# EAGLE design pager_v2 (EAGLE 7.5.0)
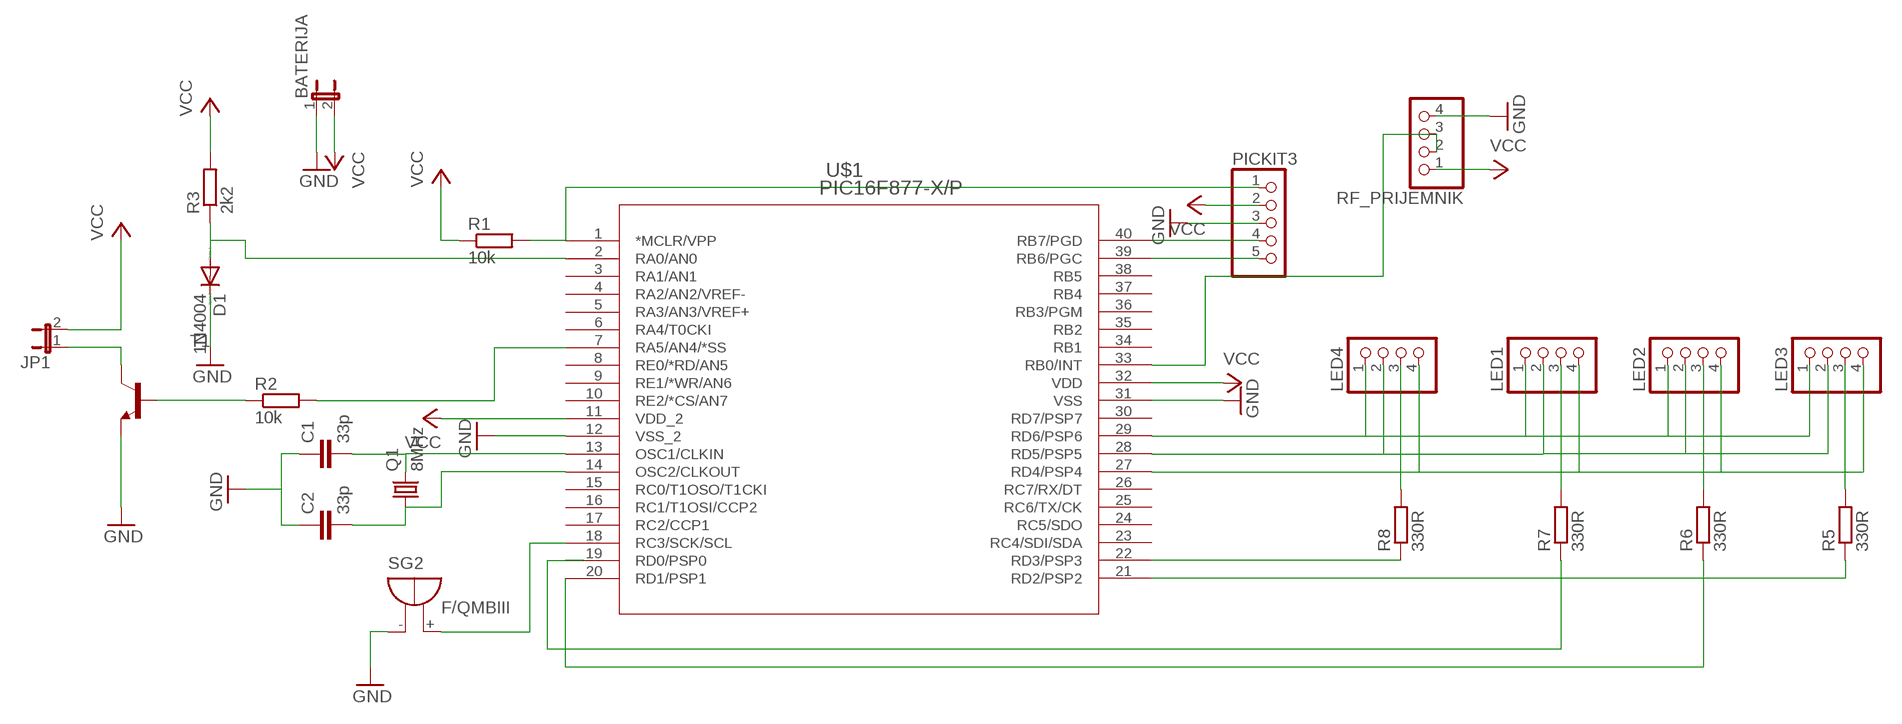
[diagram p0: schematic, sheet 1]

## Parts
BATERIJA  JP1E  [JP1]
C1  33p  C-EU025-024X044  [C025-024X044]
C2  33p  C-EU025-024X044  [C025-024X044]
D1  1N4004  [DO41-10]
JP1  JP1E  [JP1]
LED1  PINHD-1X4  [1X04]
LED2  PINHD-1X4  [1X04]
LED3  PINHD-1X4  [1X04]
LED4  PINHD-1X4  [1X04]
PICKIT3  PINHD-1X5  [1X05]
Q1  8MHz  CRYSTALHC49S  [HC49/S]
R1  10k  R-EU_0207/10  [0207/10]
R2  10k  R-EU_0207/10  [0207/10]
R3  2k2  R-EU_0207/10  [0207/10]
R5  330R  R-EU_0207/10  [0207/10]
R6  330R  R-EU_0207/10  [0207/10]
R7  330R  R-EU_0207/10  [0207/10]
R8  330R  R-EU_0207/10  [0207/10]
RF_PRIJEMNIK  PINHD-1X4  [1X04]
SG2  F/QMBIII  [F/QMBIII]
T1  -NPN-TO92-EBC  [TO92-EBC]
U$1  PIC16F877-X/P  [PDIP40_600MC]

## Nets
GND: BATERIJA.1 C1.1 C2.1 D1.C PICKIT3.3 RF_PRIJEMNIK.4 SG2.-(+) T1.E U$1.12(VSS_2) U$1.31(VSS)
N$1: C1.2 Q1.2 U$1.13(OSC1/CLKIN)
N$2: LED4.3 R8.2
N$3: C2.2 Q1.1 U$1.14(OSC2/CLKOUT)
N$4: PICKIT3.1 R1.2 U$1.1(*MCLR/VPP)
N$5: LED2.3 R6.2
N$6: R2.1 T1.B
N$7: JP1.1 T1.C
N$8: SG2.+(-) U$1.18(RC3/SCK/SCL)
N$9: RF_PRIJEMNIK.2 RF_PRIJEMNIK.3 U$1.33(RB0/INT)
N$10: LED3.3 R5.2
N$11: LED1.3 R7.2
N$12: LED1.2 LED2.2 LED3.2 LED4.2 U$1.28(RD5/PSP5)
N$13: R7.1 U$1.19(RD0/PSP0)
N$14: R6.1 U$1.20(RD1/PSP1)
N$15: R8.1 U$1.22(RD3/PSP3)
N$16: R5.1 U$1.21(RD2/PSP2)
N$17: LED1.4 LED2.4 LED3.4 LED4.4 U$1.27(RD4/PSP4)
N$18: R2.2 U$1.7(RA5/AN4/*SS)
N$19: LED1.1 LED2.1 LED3.1 LED4.1 U$1.29(RD6/PSP6)
N$20: PICKIT3.4 U$1.40(RB7/PGD)
N$21: PICKIT3.5 U$1.39(RB6/PGC)
N$22: D1.A R3.1 U$1.2(RA0/AN0)
VCC: BATERIJA.2 JP1.2 PICKIT3.2 R1.1 R3.2 RF_PRIJEMNIK.1 U$1.11(VDD_2) U$1.32(VDD)
Unconnected: U$1.3(RA1/AN1) U$1.4(RA2/AN2/VREF-) U$1.5(RA3/AN3/VREF+) U$1.6(RA4/T0CKI) U$1.8(RE0/*RD/AN5) U$1.9(RE1/*WR/AN6) U$1.10(RE2/*CS/AN7) U$1.15(RC0/T1OSO/T1CKI) U$1.16(RC1/T1OSI/CCP2) U$1.17(RC2/CCP1) U$1.23(RC4/SDI/SDA) U$1.24(RC5/SDO) U$1.25(RC6/TX/CK) U$1.26(RC7/RX/DT) U$1.30(RD7/PSP7) U$1.34(RB1) U$1.35(RB2) U$1.36(RB3/PGM) U$1.37(RB4) U$1.38(RB5)

## Library data of the parts
BATERIJA JP1 = jumper:JP1E: JUMPER
C1 C2 = rcl:C-EU: CAPACITOR, European symbol
D1 = diode:1N4004: DIODE general purpose rectifier, 1 A
LED1-LED4 RF_PRIJEMNIK = pinhead:PINHD-1X4: PIN HEADER
PICKIT3 = pinhead:PINHD-1X5: PIN HEADER
Q1 = crystal:CRYSTAL: CRYSTAL; OC_FARNELL: 1667008; OC_NEWARK: unknown
R1-R3 R5-R8 = resistor:R-EU_: RESISTOR, European symbol
SG2 = buzzer:F/QMBIII: BUZZER Source: Buerklin; OC_FARNELL: unknown; OC_NEWARK: unknown
T1 = transistor:*-NPN-: NPN Transistror BF959 corrected 2008.03.06
U$1 = PIC16F877A:PIC16F877-X/P

## Board
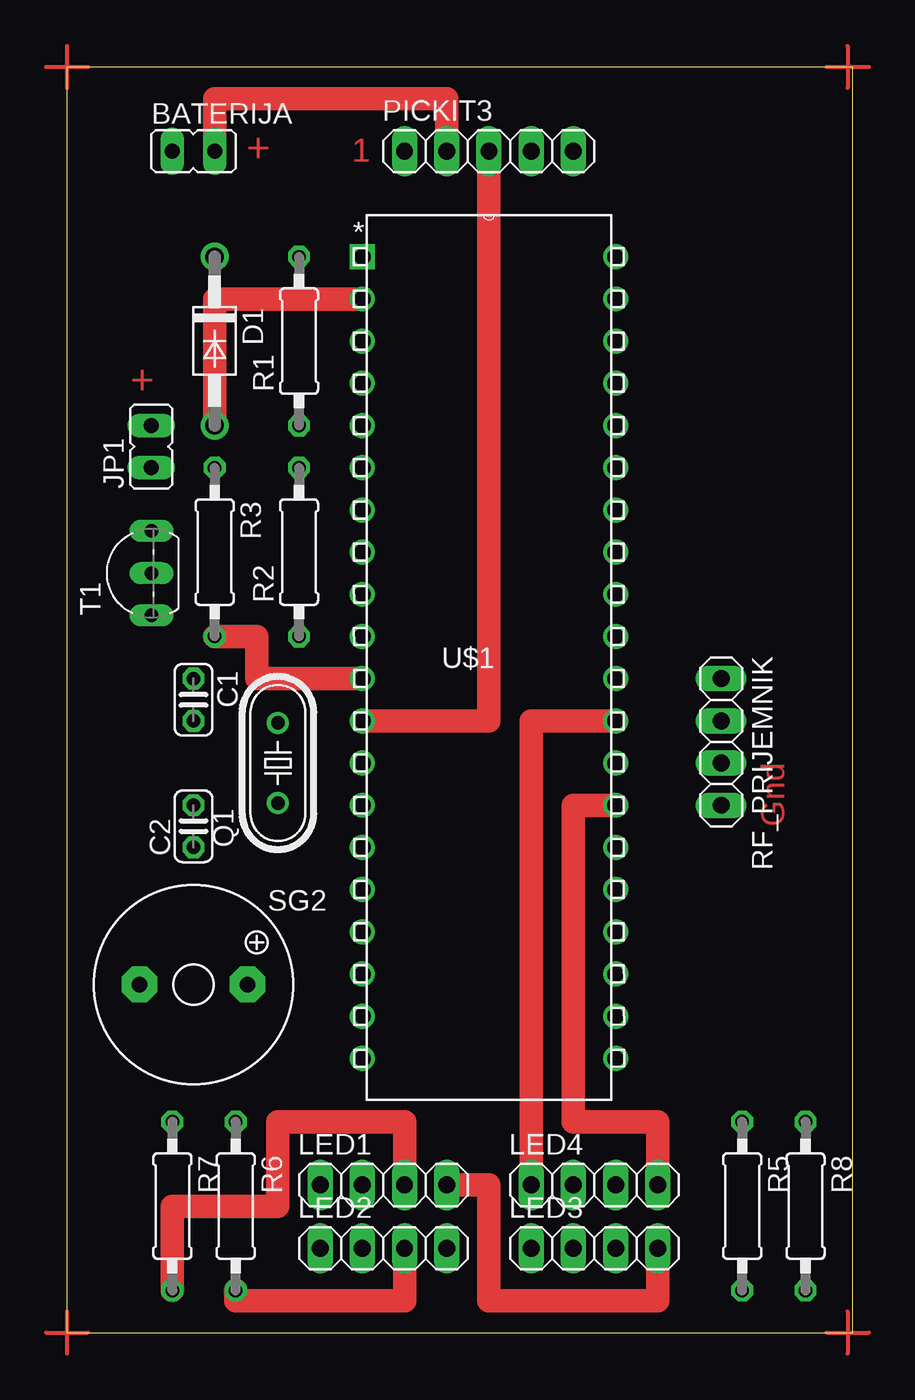
[diagram p1: board, top side]
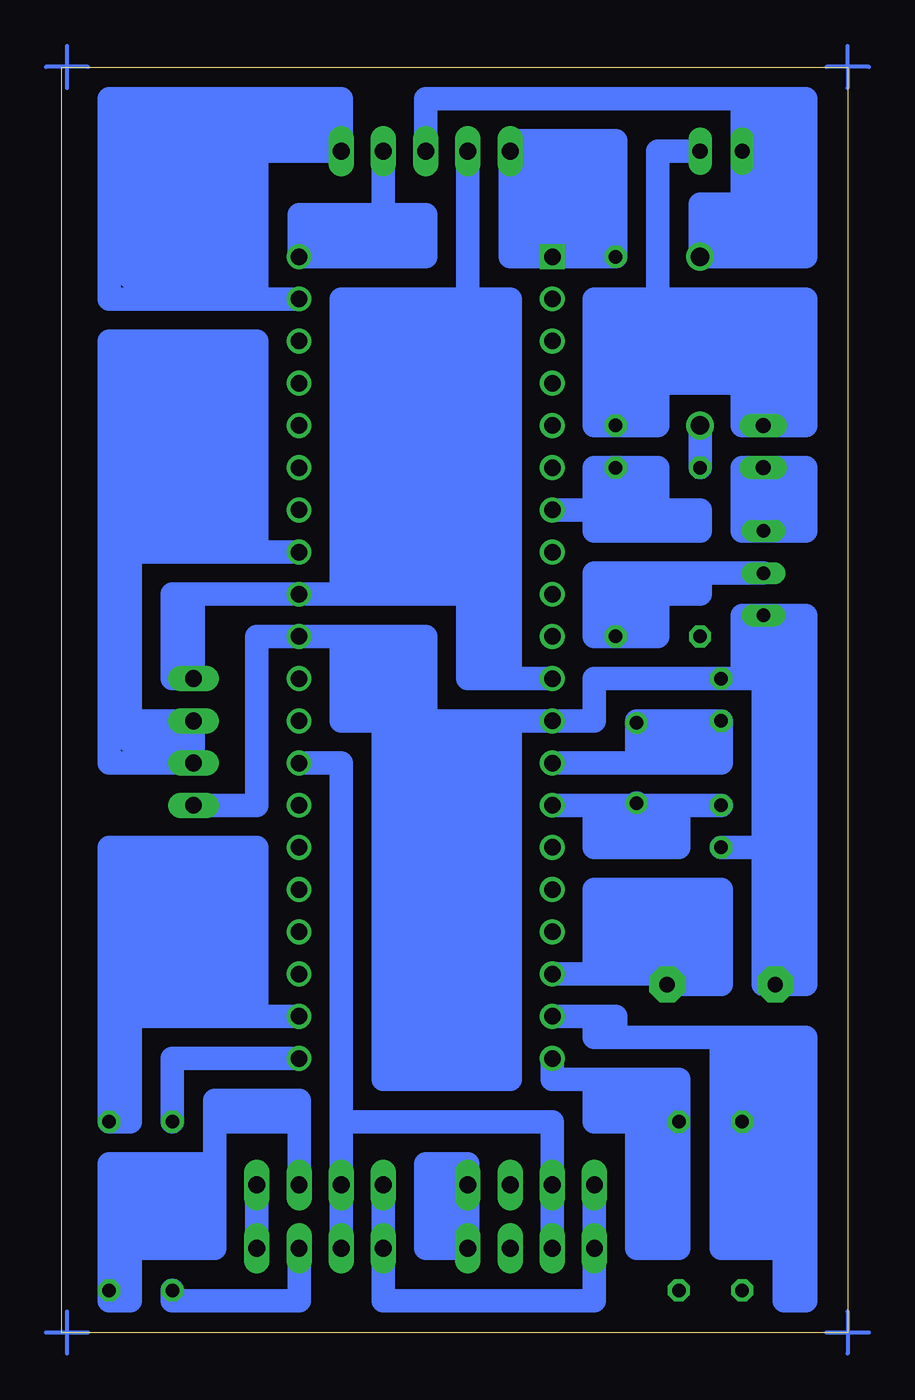
[diagram p2: board, bottom side, seen from below]

Size 47.3 x 76.19 mm. Coordinates in mm from the lower left corner, seen from the top.
Outline: 0,0 47.3,0 47.3,76.19 0,76.19 0,0
Copper layers (1*16): Top 0.035mm / dielectric 1.5mm / Bottom 0.035mm
Design rules "default": minimum track width 10mil, minimum drill 24mil, track to track 8mil, track to pad 8mil, pad to pad 8mil, via to via 8mil, smd to smd 8mil, copper to edge 40mil, drill to drill 8mil, minimum pad ring 10mil, minimum via ring 8mil, stop-mask expansion 4mil, vias tented up to drill 0mil, thermal gap 10mil

### Footprints (pad centres in the part's own frame; a part is rotated, then mirrored left to right if it is on the bottom)
JP1 = drill 0.914 long: 1 0,-1.27; 2 0,1.27
C025-024X044 = drill 0.813 octagon: 1 -1.27,0; 2 1.27,0
DO41-10 = drill 1.118: A 5.08,0; C -5.08,0
1X04 = drill 1.016 long: 1 -3.81,0; 2 -1.27,0; 3 1.27,0; 4 3.81,0
1X05 = drill 1.016 long: 1 -5.08,0; 2 -2.54,0; 3 0,0; 4 2.54,0; 5 5.08,0
HC49/S = drill 0.813: 1 -2.413,0; 2 2.413,0
0207/10 = drill 0.813 octagon: 1 -5.08,0; 2 5.08,0
F/QMBIII = drill 0.914 pad 2.159 octagon: + 3.251,0; - -3.251,0
TO92-EBC = drill 0.813 long: B 0,-1.27; C 2.54,-1.27; E -2.54,-1.27
PDIP40_600MC = drill 0.991 square: 1 -15.24,48.26 | drill 0.991: 2 -15.24,45.72; 3 -15.24,43.18; 4 -15.24,40.64; 5 -15.24,38.1; 6 -15.24,35.56; 7 -15.24,33.02; 8 -15.24,30.48; 9 -15.24,27.94; 10 -15.24,25.4; 11 -15.24,22.86; 12 -15.24,20.32; 13 -15.24,17.78; 14 -15.24,15.24; 15 -15.24,12.7; 16 -15.24,10.16; 17 -15.24,7.62; 18 -15.24,5.08; 19 -15.24,2.54; 20 -15.24,0; 21 0,0; 22 0,2.54; 23 0,5.08; 24 0,7.62; 25 0,10.16; 26 0,12.7; 27 0,15.24; 28 0,17.78; 29 0,20.32; 30 0,22.86; 31 0,25.4; 32 0,27.94; 33 0,30.48; 34 0,33.02; 35 0,35.56; 36 0,38.1; 37 0,40.64; 38 0,43.18; 39 0,45.72; 40 0,48.26

### Placement (x,y rotation side)
BATERIJA  7.62,71.12 270 top
C1  7.62,38.1 270 top
C2  7.62,30.48 90 top
D1  8.89,59.69 270 top
JP1  5.08,53.34 0 top
LED1  19.05,8.89 0 top
LED2  19.05,5.08 0 top
LED3  31.75,5.08 0 top
LED4  31.75,8.89 0 top
PICKIT3  25.4,71.12 0 top
Q1  12.7,34.29 90 top
R1  13.97,59.69 90 top
R2  13.97,46.99 90 top
R3  8.89,46.99 270 top
R5  40.64,7.62 270 top
R6  10.16,7.62 270 top
R7  6.35,7.62 270 top
R8  44.45,7.62 270 top
RF_PRIJEMNIK  39.37,35.56 270 top
SG2  7.62,20.96 0 top
T1  3.81,45.72 90 top
U$1  33.02,16.51 0 top

### Tracks (layer width: path | path; a pad name or v marks a point on that pad's centre or on a via)
GND
  Top 1.422: U$1.12 25.4,36.83 PICKIT3.3
  Bottom 1.422: RF_PRIJEMNIK.4 35.56,31.75 35.56,41.91 U$1.31 30.48,41.91 | 25.4,40.64 25.4,41.91 26.67,41.91 | 22.86,36.83 20.32,36.83 | 20.32,36.83 20.32,35.56 | 20.32,35.56 20.32,15.24 21.59,15.24 | 21.59,15.24 27.94,15.24 27.94,16.51 | 27.94,16.51 27.94,34.29 | 27.94,36.83 29.21,36.83 | 30.48,41.91 29.21,41.91 | 25.4,36.83 25.4,35.56 | 24.13,35.56 22.86,35.56 | 22.86,35.56 21.59,35.56 | 20.32,35.56 21.59,35.56 | 21.59,35.56 21.59,16.51 | 21.59,15.24 21.59,16.51 | 21.59,16.51 22.86,16.51 | 22.86,16.51 26.67,16.51 | 27.94,16.51 26.67,16.51 | 26.67,16.51 26.67,17.78 | 26.67,36.83 25.4,36.83 | 25.4,36.83 22.86,36.83 | 22.86,36.83 22.86,35.56 | 22.86,35.56 22.86,17.78 | 22.86,16.51 22.86,17.78 | 22.86,17.78 24.13,17.78 | 24.13,17.78 25.4,17.78 | 25.4,17.78 25.4,34.29 | 25.4,34.29 25.4,35.56 | 25.4,35.56 24.13,35.56 | 24.13,35.56 24.13,17.78 | 25.4,17.78 26.67,17.78 | 26.67,17.78 26.67,36.83 | 26.67,38.1 26.67,41.91 | 26.67,41.91 29.21,41.91 | 29.21,41.91 29.21,40.64 | 29.21,40.64 29.21,38.1 | 27.94,38.1 26.67,38.1 | 26.67,38.1 26.67,36.83 | 26.67,36.83 27.94,36.83 | 27.94,36.83 27.94,38.1 | 27.94,38.1 27.94,40.64 | 27.94,40.64 29.21,40.64 | 27.94,40.64 25.4,40.64 | 25.4,40.64 25.4,36.83 | 25.4,34.29 27.94,34.29 | 27.94,34.29 27.94,36.83 | 27.94,38.1 29.21,38.1 | 29.21,38.1 29.21,36.83 | 29.21,36.83 30.48,36.83 30.48,41.91 | 6.35,39.37 C1.1 15.24,39.37 15.24,36.83 U$1.12 20.32,36.83 | 5.08,29.21 C2.1 | 5.08,29.21 5.08,39.37 | 5.08,29.21 5.08,20.96 | PICKIT3.3 25.4,74.3 2.54,74.3 2.54,64.77 3.81,64.77 | BATERIJA.1 6.35,69.85 | 6.35,69.85 6.35,68.58 | 8.89,67.31 8.89,67.95 5.08,67.95 | 4.44,67.95 5.08,67.95 | 5.08,67.95 5.08,68.58 | 5.08,72.39 5.08,73.66 6.35,73.66 6.35,72.39
  Bottom 1.422: 6.35,72.39 5.08,72.39 | 5.08,72.39 5.08,69.85 | 3.81,71.12 3.81,73.66 | 3.81,68.58 3.81,64.77 | 3.81,64.77 5.08,64.77 | 5.08,64.77 5.08,67.31 | 5.08,68.58 6.35,68.58 | 6.35,68.58 6.35,66.04 | 6.35,66.04 6.35,64.77 | 6.35,66.04 8.89,66.04 | 8.89,67.31 5.08,67.31 | 5.08,67.31 5.08,67.95 | 5.08,68.58 3.81,68.58 | 3.81,68.58 3.81,71.12 | 3.81,71.12 BATERIJA.1 | 6.35,72.39 BATERIJA.1 | 6.35,69.85 5.08,69.85 | 5.08,69.85 5.08,68.58 | SG2.- 2.54,20.96 2.54,43.18 3.81,43.18 | 3.81,21.59 3.81,43.18 | 3.81,43.18 T1.E | 5.08,39.37 T1.E | T1.E 6.35,43.18 6.35,39.37 | 5.08,39.37 6.35,39.37 | 5.08,64.77 D1.C 8.89,66.04 | 8.89,67.31 8.89,66.04
N$1
  Bottom 1.422: U$1.13 12.7,34.29 | 12.7,35.56 Q1.2 | Q1.2 7.62,36.7 7.62,35.56 | 7.62,35.56 7.62,34.29 12.7,34.29 | 12.7,34.29 12.7,35.56 | 7.62,35.56 12.7,35.56 | Q1.2 12.7,36.83 C1.2
N$2
  Bottom 1.422: 36.83,13.97 36.83,12.7 | LED4.3 33.02,12.7 | 33.02,12.7 36.83,12.7 | 36.83,13.97 33.02,13.97 33.02,12.7 | 38.1,10.16 38.1,5.08 39.37,5.08 | 39.37,5.08 43.18,5.08 | 43.18,10.16 38.1,10.16 | 38.1,10.16 39.37,8.89 | 39.37,5.08 39.37,6.35 | 40.64,6.35 43.18,6.35 | 43.18,6.35 43.18,7.62 | 43.18,8.89 40.64,8.89 | 40.64,7.62 43.18,7.62 | 43.18,8.89 43.18,10.16 | 43.18,8.89 43.18,7.62 | 43.18,6.35 43.18,5.08 | 40.64,8.89 39.37,8.89 | 39.37,8.89 39.37,6.35 | 39.37,6.35 40.64,6.35 | 40.64,6.35 40.64,7.62 | 40.64,8.89 40.64,7.62 | 36.83,12.7 38.1,12.7 | 38.1,12.7 38.1,13.97 36.83,13.97 | 38.1,12.7 38.1,10.16 | 43.18,5.08 43.18,1.9 44.45,1.9 R8.2 44.45,10.16 43.18,10.16
N$3
  Bottom 1.422: 12.83,31.75 Q1.1 12.7,31.75 | 12.7,29.21 11.43,29.21 | 12.7,29.21 12.7,30.48 | 12.83,31.75 13.97,31.75 | 15.24,31.75 U$1.14 | 12.7,29.21 15.24,29.21 15.24,30.48 | 15.24,30.48 15.24,31.75 | 15.24,31.75 13.97,31.75 | 13.97,30.48 12.7,30.48 | 15.24,30.48 13.97,30.48 | 13.97,30.48 13.97,31.75 | 12.7,31.75 11.43,31.75 | 11.43,29.21 11.43,30.48 | 11.43,31.75 11.43,30.48 | 11.43,30.48 12.7,30.48 | 12.7,30.48 12.7,31.75 | 12.83,31.75 12.7,31.75 | C2.2 10.16,31.75 | 11.43,29.21 10.16,29.21 10.16,31.75 | 10.16,31.75 11.43,31.75
N$4
  Bottom 1.422: PICKIT3.1 20.32,64.77 U$1.1 | 13.97,68.58 13.97,67.31 16.51,67.31 | 13.97,69.85 13.97,71.12 14.61,71.12 | 16.51,71.12 18.42,71.12 | 18.42,71.12 19.05,71.12 | 19.05,71.12 19.05,69.85 | 19.05,68.58 19.05,69.85 | 19.05,69.85 13.97,69.85 | 13.97,69.85 13.97,68.58 | 13.97,68.58 16.51,68.58 | 19.05,68.58 19.05,67.31 | 19.05,67.31 16.51,67.31 | 16.51,64.77 R1.2 13.97,66.04 | 16.51,64.77 16.51,66.04 | 14.61,66.04 16.51,66.04 | 19.05,66.04 19.05,67.31 | 19.05,68.58 16.51,68.58 | 16.51,68.58 16.51,67.31 | 16.51,64.77 19.05,64.77 19.05,66.04 | 19.05,66.04 16.51,66.04 | 16.51,67.31 16.51,66.04 | 16.51,68.58 16.51,71.12 | 19.05,71.12 PICKIT3.1 | PICKIT3.1 20.32,71.76 18.42,71.76 | 14.61,71.12 14.61,66.04 | 14.61,66.04 13.97,66.04 | 13.97,66.04 13.97,71.76 18.42,71.76 | 18.42,71.76 18.42,71.12 | 16.51,71.12 14.61,71.12
N$5
  Top 1.422: LED2.3 20.32,1.9 10.16,1.9 R6.2
N$6
  Bottom 1.422: R2.1 15.24,41.91 15.24,45.72 13.97,45.72 | 13.97,45.72 12.7,45.72 | R2.1 13.97,44.45 | 8.89,45.72 T1.B | 11.43,44.45 8.89,44.45 8.89,45.72 | 11.43,44.45 11.43,41.91 12.7,41.91 | R2.1 12.7,41.91 | 12.7,41.91 12.7,45.72 | 12.7,45.72 8.89,45.72 | 11.43,44.45 13.97,44.45 | 13.97,44.45 13.97,45.72
N$7
  Bottom 1.422: T1.C 3.81,48.26 | 3.81,48.26 2.54,48.26 2.54,52.07 3.81,52.07 | JP1.1 6.35,52.07 6.35,48.26 T1.C | 3.81,48.26 3.81,52.07 | 3.81,52.07 JP1.1 | T1.C JP1.1
N$8
  Bottom 1.422: SG2.+ 8.89,20.96 8.89,21.59 | 10.16,26.67 15.24,26.67 15.24,25.4 | 15.24,25.4 15.24,21.59 | 15.24,21.59 13.97,21.59 | 11.43,21.59 10.16,21.59 | 8.89,21.59 9.53,21.59 | 9.53,21.59 10.16,21.59 | 10.16,21.59 10.16,25.4 | 10.16,26.67 10.16,25.4 | 10.16,25.4 11.43,25.4 | 12.7,25.4 13.97,25.4 | 15.24,25.4 13.97,25.4 | 13.97,25.4 13.97,21.59 | 13.97,21.59 12.7,21.59 | 12.7,21.59 11.43,21.59 | 11.43,21.59 11.43,25.4 | 11.43,25.4 12.7,25.4 | 12.7,21.59 12.7,25.4 | 10.16,26.67 7.62,26.67 7.62,20.96 9.53,20.96 9.53,21.59 | 8.89,21.59 8.25,21.59 8.25,26.04 9.53,26.04 9.53,22.23 8.89,22.23 8.89,24.77 13.33,24.77 13.33,26.04 8.89,26.04 8.89,21.59 | 15.24,21.59 U$1.18
N$9
  Bottom 1.422: 43.18,46.99 38.1,46.99 | 38.1,46.99 36.83,46.99 | 35.56,46.99 U$1.33 | RF_PRIJEMNIK.2 41.91,36.83 | 41.91,36.83 43.18,36.83 | 43.18,35.56 39.37,35.56 RF_PRIJEMNIK.2 | RF_PRIJEMNIK.2 RF_PRIJEMNIK.3 43.18,34.29 | 41.91,36.83 43.18,35.56 | 43.18,36.83 43.18,35.56 | 43.18,34.29 41.91,36.83 | 43.18,58.42 43.18,59.69 | 43.18,59.69 36.83,59.69 | 36.83,59.69 35.56,59.69 35.56,46.99 | 35.56,46.99 36.83,46.99 | 36.83,46.99 36.83,57.15 | 36.83,57.15 36.83,58.42 | 36.83,59.69 36.83,58.42 | 36.83,58.42 41.91,58.42 | 41.91,58.42 43.18,58.42 | 43.18,46.99 43.18,48.26 | 43.18,48.26 43.18,57.15 | 43.18,57.15 41.91,57.15 | 41.91,57.15 40.64,57.15 | 36.83,57.15 38.1,57.15 | 38.1,55.88 38.1,48.26 | 38.1,46.99 38.1,48.26 | 38.1,48.26 39.37,48.26 | 40.64,48.26 41.91,48.26 | 43.18,48.26 41.91,48.26 | 41.91,48.26 41.91,55.88 | 41.91,57.15 41.91,55.88 | 41.91,55.88 39.37,55.88 | 39.37,55.88 38.1,55.88 | 38.1,55.88 38.1,57.15 | 38.1,57.15 39.37,57.15 | 39.37,57.15 39.37,55.88 | 39.37,55.88 39.37,48.26 | 39.37,48.26 40.64,48.26 | 40.64,48.26 40.64,57.15 | 39.37,57.15 40.64,57.15 | 41.91,57.15 41.91,58.42 | 43.18,58.42 43.18,57.15 | 43.18,46.99 43.18,36.83 | 43.18,34.29 44.45,34.29 44.45,59.69 43.18,59.69 | 43.18,58.42 43.18,36.83
N$10
  Bottom 1.422: LED3.3 33.02,1.9 40.64,1.9 R5.2
N$11
  Top 1.422: R7.2 6.35,7.62 12.7,7.62 12.7,12.7 20.32,12.7 LED1.3
N$12
  Bottom 1.422: LED2.2 LED1.2 17.78,12.7 30.48,12.7 | LED3.2 LED4.2 30.48,12.7 | 30.48,12.7 30.48,34.29 U$1.28
N$13
  Bottom 1.422: 6.35,15.24 5.08,17.78 | 3.18,17.78 3.81,17.78 4.44,17.78 | 3.18,17.78 3.18,16.51 | 3.18,3.18 3.18,1.9 | 2.54,3.18 2.54,5.08 | 4.44,5.08 3.81,6.35 | 3.81,6.35 5.08,5.71 | R7.1 5.08,12.7 | 5.08,12.7 4.44,12.7 | 4.44,12.7 4.44,17.14 | 4.44,17.14 3.81,17.14 3.81,16.51 | 3.18,16.51 3.18,3.18 | 2.54,15.24 2.54,15.88 | 2.54,15.88 3.81,15.88 | 3.81,15.88 3.81,15.24 | 3.81,15.24 3.81,12.7 | 3.81,7.62 3.81,6.35 | 3.81,6.35 2.54,6.35 | 2.54,5.08 2.54,6.35 | 2.54,6.35 2.54,15.24 | 2.54,15.24 3.81,15.24 | 3.81,15.24 4.44,15.24 4.44,5.71 5.08,5.71 | 5.08,5.71 5.08,7.62 | 5.08,7.62 5.08,8.26 | 5.08,8.26 3.81,8.26 | 3.81,8.26 3.81,12.7 | 3.81,12.7 4.44,12.7 | 4.44,17.14 4.44,17.78 | 5.08,17.78 6.35,17.78 | 6.35,17.78 7.62,17.78 | 7.62,17.78 13.97,17.78 | 3.18,3.18 2.54,3.18 | 2.54,3.18 2.54,2.54 | U$1.19 15.24,19.05 | 15.24,19.05 13.97,19.05 13.97,17.78 | 13.97,17.78 15.24,17.78 15.24,19.05 | 5.08,8.26 6.35,8.26 | 6.35,8.26 6.35,5.08 | 6.35,8.26 R7.1 | 6.35,16.51 6.35,17.78 | 5.08,17.78 5.08,15.24 | 5.08,12.7 5.08,10.16 | 5.08,10.16 5.08,8.26 | 5.08,7.62 3.81,7.62 | 3.81,7.62 3.81,8.26 | 3.81,15.88 3.81,16.51 | 7.62,16.51 7.62,17.78 | R7.1 7.62,5.08 | 2.54,5.08 3.81,5.08 | 3.81,5.08 4.44,5.08 | 3.81,5.08 3.81,5.71 | 3.81,5.71 6.35,5.71 R7.1 | R7.1 6.35,15.24 | 6.35,15.24 5.08,15.24 | 5.08,15.24 5.08,13.97 | 5.08,13.97 5.08,12.7 | 5.08,10.16 6.35,10.16 R7.1 | 3.81,16.51 3.18,16.51 | 3.81,16.51 6.35,16.51 | 5.08,5.71 6.35,5.08 | 7.62,13.97 7.62,5.08 | 5.08,5.08 5.08,5.71 | 5.08,13.97 7.62,13.97 | 7.62,13.97 7.62,16.51 | 7.62,16.51 6.35,16.51 | 6.35,16.51 R7.1 | 3.81,6.35 3.81,5.71 | 4.44,5.08 5.08,5.08 | 6.35,5.08 7.62,5.08 | 6.35,5.08 5.08,5.08 | 3.81,2.54 3.81,1.9 3.18,1.9 | 3.18,1.9 2.54,1.9 2.54,2.54
  Bottom 1.422: 2.54,2.54 3.81,2.54 | 3.81,2.54 3.81,5.08 | 2.54,15.88 2.54,17.78 3.18,17.78 | 5.08,17.78 4.44,17.78
N$14
  Bottom 1.422: U$1.20 17.78,15.24 15.24,15.24 | 11.43,5.08 10.16,5.08 R6.1 | 15.24,13.97 15.24,12.7 12.7,12.7 | 15.24,13.97 15.24,15.24 | 15.24,15.24 11.43,15.24 | 11.43,15.24 10.16,15.24 10.16,13.97 | 11.43,6.35 11.43,13.97 | 15.24,13.97 11.43,13.97 | 12.7,12.7 R6.1 | R6.1 10.16,13.97 | 10.16,13.97 11.43,13.97 | 11.43,13.97 11.43,15.24 | 12.7,5.71 11.43,5.71 | 11.43,5.71 11.43,5.08 | 12.7,12.7 12.7,6.35 | 11.43,5.08 12.7,5.08 12.7,5.71 | 11.43,5.71 11.43,6.35 | 11.43,6.35 12.7,6.35 | 12.7,6.35 12.7,5.71
N$15
  Bottom 1.422: 35.56,19.05 U$1.22 | 43.18,19.05 36.83,19.05 | 36.83,19.05 35.56,19.05 | 35.56,19.05 35.56,29.21 36.83,29.21 | 43.18,19.05 43.18,20.32 | 43.18,26.67 43.18,27.94 | 43.18,29.21 36.83,29.21 | 36.83,29.21 36.83,27.94 | 36.83,27.94 36.83,20.32 | 36.83,19.05 36.83,20.32 | 36.83,20.32 38.1,20.32 | 38.1,20.32 40.64,20.32 | 40.64,20.32 43.18,20.32 | 43.18,20.32 43.18,21.59 | 43.18,21.59 43.18,26.67 | 43.18,27.94 38.1,27.94 | 36.83,27.94 38.1,27.94 | 38.1,26.67 38.1,21.59 | 38.1,20.32 38.1,21.59 | 41.91,21.59 43.18,21.59 | 43.18,29.21 43.18,27.94 | 38.1,27.94 38.1,26.67 | 38.1,26.67 39.37,26.67 | 40.64,26.67 41.91,26.67 | 43.18,26.67 41.91,26.67 | 41.91,26.67 41.91,21.59 | 41.91,21.59 39.37,21.59 | 38.1,21.59 39.37,21.59 | 39.37,21.59 39.37,26.67 | 39.37,26.67 40.64,26.67 | 40.64,26.67 40.64,20.32 | 43.18,19.05 43.18,12.7 R8.1 44.45,29.21 43.18,29.21
N$16
  Bottom 1.422: R5.1 40.64,16.51 U$1.21
N$17
  Top 1.422: LED1.4 25.4,8.89 25.4,1.9 35.56,1.9 LED3.4 | U$1.27 30.48,31.75 30.48,12.7 35.56,12.7 LED4.4
  Bottom 1.422: LED4.4 LED3.4 | LED1.4 25.4,8.89 | LED1.4 22.86,10.16 25.4,10.16 25.4,8.89 | 25.4,7.62 25.4,5.08 24.13,5.08 | 24.13,7.62 22.86,7.62 | 24.13,5.08 LED2.4 22.86,6.35 | 24.13,5.08 24.13,6.35 | 24.13,7.62 24.13,6.35 | 24.13,6.35 22.86,6.35 | LED1.4 22.86,6.35 | 24.13,7.62 25.4,7.62 | 25.4,8.89 25.4,7.62
N$18
  Bottom 1.422: 11.43,49.53 11.43,52.07 12.7,52.07 | 11.43,49.53 8.89,49.53 8.89,48.26 11.43,48.26 | 12.7,48.26 13.97,48.26 | 13.97,48.26 15.24,48.26 15.24,49.53 | 15.24,49.53 15.24,52.07 R2.2 | 11.43,49.53 11.43,48.26 | R2.2 13.97,48.26 | 11.43,48.26 12.7,48.26 | 12.7,48.26 12.7,52.07 | 12.7,52.07 R2.2 | U$1.7 15.24,49.53
N$19
  Top 1.422: LED4.1 27.94,36.83 U$1.29
  Bottom 1.422: LED1.1 LED2.1 15.24,1.9 27.94,1.9 LED3.1 LED4.1
N$20
  Bottom 1.422: 27.94,64.77 U$1.40 | PICKIT3.4 27.94,67.31 | 26.67,64.77 25.4,64.77 25.4,67.31 26.67,67.31 | 26.67,64.77 U$1.40 | 33.02,66.04 33.02,67.31 27.94,67.31 | 27.94,67.31 26.67,67.31 | 26.67,66.04 33.02,66.04 | 33.02,66.04 U$1.40 | 26.67,67.31 26.67,66.04 | 26.67,64.77 26.67,66.04
N$21
  Bottom 1.422: 35.56,71.12 35.56,62.23 | 35.56,62.23 U$1.39 | PICKIT3.5 30.48,74.3 31.75,74.3 | 31.75,74.3 31.75,71.12 PICKIT3.5 | PICKIT3.5 33.02,71.12 | 33.02,71.12 34.29,71.12 | 35.56,71.12 36.83,71.12 | 36.83,71.12 36.83,74.3 | 31.75,74.3 33.02,74.3 | 33.02,71.12 33.02,74.3 | 33.02,74.3 34.29,74.3 | 34.29,74.3 34.29,71.12 | 34.29,71.12 35.56,71.12 | 34.29,74.3 35.56,74.3 | 35.56,74.3 36.83,74.3 | 36.83,71.12 36.83,62.23 | 36.83,62.23 35.56,62.23 | 36.83,74.3 38.1,74.3 | 40.64,62.23 39.37,62.23 | 39.37,62.23 38.1,62.23 | 36.83,62.23 38.1,62.23 | 38.1,62.23 38.1,73.66 | 38.1,73.66 38.1,74.3 | 38.1,74.3 43.18,74.3 | 43.18,74.3 43.18,73.66 | 43.18,73.66 41.91,73.66 | 41.91,73.66 40.64,73.66 | 40.64,73.66 39.37,73.66 | 38.1,73.66 39.37,73.66 | 39.37,73.66 39.37,63.5 | 39.37,62.23 39.37,63.5 | 39.37,63.5 40.64,63.5 | 40.64,63.5 43.18,63.5 43.18,64.77 | 40.64,62.23 44.45,62.23 44.45,74.3 43.18,74.3 | 40.64,62.23 40.64,63.5 | 40.64,63.5 40.64,64.77 | 40.64,64.77 40.64,72.39 | 40.64,73.66 40.64,72.39 | 40.64,72.39 43.18,72.39 | 43.18,72.39 43.18,64.77 | 43.18,64.77 41.91,64.77 | 40.64,64.77 41.91,64.77 | 41.91,64.77 41.91,73.66 | 38.1,73.66 35.56,73.66 | 35.56,73.66 35.56,74.3 | 35.56,73.66 35.56,71.12 | 43.18,73.66 43.18,72.39
N$22
  Top 1.422: U$1.2 8.89,62.23 D1.A
  Bottom 1.422: D1.A R3.1
N$23
  Bottom 0.254: 0,77.47 0,76.2 0,74.93
N$24
  Bottom 0.254: -1.27,76.2 1.27,76.2
N$25
  Bottom 0.254: 0,1.27 0,-1.27
N$26
  Bottom 0.254: -1.27,0 1.27,0
N$27
  Bottom 0.254: 45.72,0 48.26,0
N$28
  Bottom 0.254: 46.99,1.27 46.99,-1.27
N$29
  Bottom 0.254: 45.72,76.2 48.26,76.2
N$30
  Bottom 0.254: 46.99,77.47 46.99,74.93
N$31
  Top 0.254: 0,77.47 0,74.93
N$32
  Top 0.254: -1.27,76.2 1.27,76.2
N$33
  Top 0.254: 45.72,76.2 48.26,76.2
N$34
  Top 0.254: 46.99,77.47 46.99,74.93
N$35
  Top 0.254: 46.99,1.27 46.99,-1.27
N$36
  Top 0.254: 45.72,0 48.26,0
N$37
  Top 0.254: -1.27,0 1.27,0
N$38
  Top 0.254: 0,1.27 0,-1.27
VCC
  Top 1.422: BATERIJA.2 8.89,74.3 22.86,74.3 PICKIT3.2 | R3.2 11.43,41.91 11.43,39.37 U$1.11
  Bottom 1.422: 39.37,43.18 39.37,44.45 | 30.48,44.45 U$1.32 39.37,44.45 | 29.21,44.45 27.94,44.45 | 24.13,44.45 22.86,44.45 | 22.86,43.18 22.86,39.37 21.59,39.37 | 20.32,39.37 U$1.11 | 20.32,44.45 20.32,43.18 | 20.32,43.18 20.32,39.37 | 20.32,39.37 21.59,39.37 | 21.59,39.37 21.59,43.18 | 21.59,43.18 20.32,43.18 | 21.59,43.18 22.86,43.18 | 22.86,43.18 22.86,44.45 | 22.86,44.45 21.59,44.45 | 20.32,46.99 20.32,59.69 | 29.21,62.23 30.48,62.23 30.48,44.45 | 30.48,44.45 29.21,44.45 | 29.21,44.45 29.21,60.96 21.59,60.96 | 21.59,60.96 21.59,59.69 | 21.59,59.69 21.59,46.99 | 26.67,45.72 27.94,45.72 27.94,58.42 | 22.86,59.69 22.86,45.72 | 24.13,45.72 26.67,45.72 | 26.67,45.72 26.67,46.99 | 26.67,46.99 26.67,58.42 | 26.67,58.42 25.4,58.42 | 25.4,58.42 24.13,58.42 | 24.13,58.42 24.13,54.61 | 24.13,54.61 24.13,46.99 | 24.13,46.99 25.4,46.99 | 26.67,46.99 25.4,46.99 | 25.4,46.99 25.4,58.42 | 26.67,58.42 27.94,58.42 | 27.94,58.42 27.94,59.69 | 27.94,59.69 24.13,59.69 | 24.13,59.69 22.86,59.69 | 22.86,59.69 21.59,59.69 | 21.59,59.69 20.32,59.69 | 20.32,59.69 20.32,62.23 21.59,62.23 | 24.13,62.23 24.13,59.69 | 27.94,59.69 29.21,59.69 29.21,62.23 | 29.21,62.23 24.13,62.23 | 21.59,60.96 21.59,62.23 | 21.59,62.23 24.13,62.23 | 24.13,59.69 24.13,58.42 | 24.13,54.61 27.94,54.61 27.94,44.45 | 27.94,44.45 24.13,44.45 | 24.13,44.45 24.13,45.72 | 24.13,45.72 24.13,46.99 | 24.13,46.99 21.59,46.99 | 20.32,45.72 20.32,44.45 | 20.32,44.45 21.59,44.45 | 21.59,45.72 20.32,45.72 | 20.32,45.72 20.32,46.99 | 20.32,46.99 21.59,46.99 | 21.59,46.99 21.59,45.72 | 21.59,44.45 21.59,45.72 | 24.13,45.72 22.86,45.72 | 21.59,45.72 22.86,45.72 | 22.86,59.69 PICKIT3.2 | 39.37,44.45 40.64,44.45 40.64,43.18 | 40.64,41.91 40.64,39.37 RF_PRIJEMNIK.1 39.37,40.64
  Bottom 1.422: 39.37,41.91 39.37,43.18 | 39.37,43.18 40.64,43.18 | 40.64,43.18 40.64,41.91 | 40.64,41.91 39.37,40.64 | 39.37,40.64 39.37,41.91 | 39.37,41.91 40.64,43.18 | R1.1 12.7,54.61 | 11.43,57.15 11.43,59.69 | 11.43,60.96 11.43,62.23 | 11.43,62.23 11.43,71.12 BATERIJA.2 | 5.08,57.15 JP1.2 | JP1.2 2.54,54.61 2.54,62.23 3.81,62.23 | 3.81,62.23 10.16,62.23 | 10.16,59.69 10.16,58.42 | 10.16,57.15 7.62,57.15 | 7.62,57.15 6.35,57.15 | 6.35,57.15 6.35,54.61 JP1.2 | JP1.2 3.81,54.61 3.81,57.15 | 3.81,59.69 3.81,60.96 | 3.81,62.23 3.81,60.96 | 3.81,60.96 10.16,60.96 | 10.16,60.96 10.16,59.69 | 10.16,59.69 3.81,59.69 | 3.81,59.69 3.81,58.42 | 7.62,58.42 10.16,58.42 | 10.16,58.42 10.16,57.15 | 6.35,57.15 3.81,57.15 | 3.81,57.15 3.81,58.42 | 3.81,58.42 7.62,58.42 | 7.62,58.42 7.62,57.15 | 10.16,57.15 11.43,57.15 | 11.43,57.15 13.97,57.15 | 13.97,57.15 R1.1 | 15.24,57.15 15.24,55.88 | 15.24,55.88 15.24,54.61 R1.1 | 12.7,54.61 11.43,54.61 11.43,55.88 | 11.43,55.88 15.24,55.88 | 12.7,62.23 12.7,60.96 | 12.7,59.69 12.7,54.61 | 11.43,62.23 10.16,62.23 | 12.7,62.23 13.97,62.23 | 13.97,62.23 15.24,62.23 15.24,57.15 | 15.24,57.15 13.97,57.15 | 13.97,57.15 13.97,62.23 | 12.7,62.23 11.43,62.23 | 10.16,62.23 10.16,60.96 | 10.16,60.96 11.43,60.96 | 11.43,60.96 12.7,60.96 | 12.7,60.96 12.7,59.69 | 12.7,59.69 11.43,59.69 | 11.43,59.69 11.43,60.96 | 11.43,57.15 11.43,55.88

### Text on the board
Top: + | 1 | + | Gnd